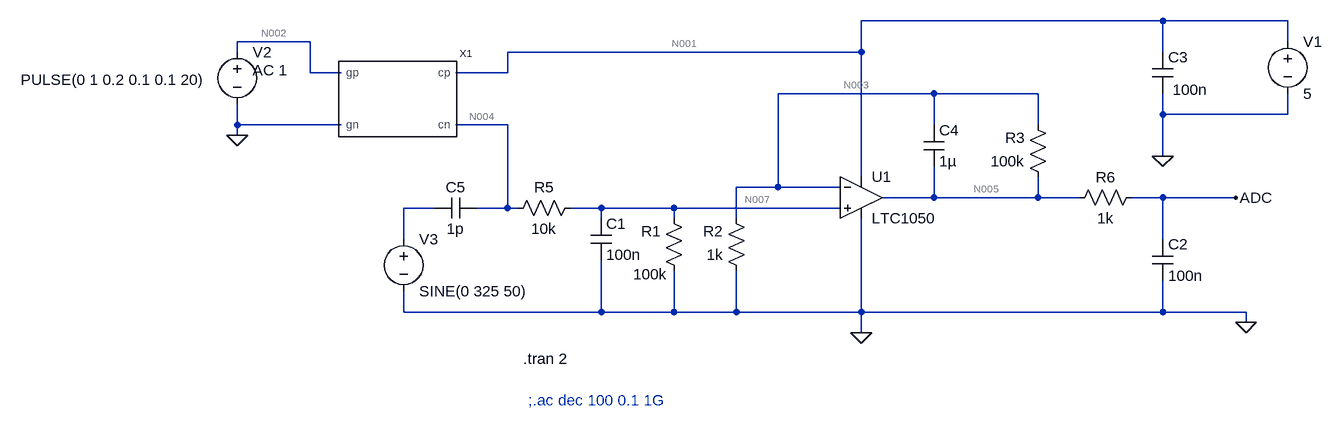
[diagram p0: schematic AmpliCapteur.asc]
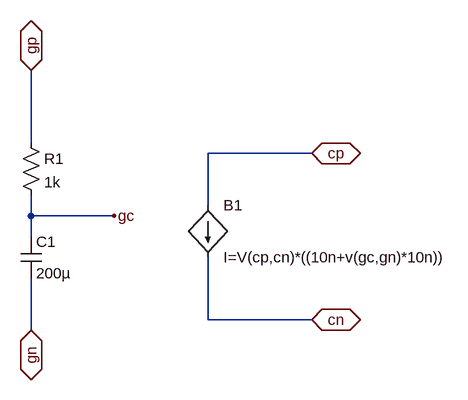
[diagram p1: sub-circuit capteur_gaz.asc]
AmpliCapteur.asc, the LTspice schematic file:
Version 4
SHEET 1 1176 680
WIRE 928 -144 464 -144
WIRE 1120 -144 928 -144
WIRE -384 -112 -496 -112
WIRE 1120 -112 1120 -144
WIRE -496 -96 -496 -112
WIRE 464 -96 464 -144
WIRE 464 -96 -80 -96
WIRE 928 -96 928 -144
WIRE -384 -64 -384 -112
WIRE -336 -64 -384 -64
WIRE -80 -64 -80 -96
WIRE -80 -64 -160 -64
WIRE 576 -32 336 -32
WIRE 736 -32 576 -32
WIRE 928 0 928 -32
WIRE 1120 0 1120 -32
WIRE 1120 0 928 0
WIRE -496 16 -496 -16
WIRE -336 16 -496 16
WIRE -80 16 -160 16
WIRE 576 16 576 -32
WIRE 736 16 736 -32
WIRE -496 32 -496 16
WIRE 928 64 928 0
WIRE 464 96 464 -96
WIRE 336 112 336 -32
WIRE 336 112 272 112
WIRE 432 112 336 112
WIRE 576 128 576 80
WIRE 576 128 496 128
WIRE 736 128 736 96
WIRE 736 128 576 128
WIRE 800 128 736 128
WIRE 928 128 880 128
WIRE 1040 128 928 128
WIRE -192 144 -240 144
WIRE -80 144 -80 16
WIRE -80 144 -128 144
WIRE -64 144 -80 144
WIRE 64 144 16 144
WIRE 176 144 64 144
WIRE 432 144 176 144
WIRE 64 160 64 144
WIRE 176 160 176 144
WIRE 272 160 272 112
WIRE -240 192 -240 144
WIRE 928 192 928 128
WIRE -240 304 -240 272
WIRE 64 304 64 224
WIRE 64 304 -240 304
WIRE 176 304 176 240
WIRE 176 304 64 304
WIRE 272 304 272 240
WIRE 272 304 176 304
WIRE 464 304 464 160
WIRE 464 304 272 304
WIRE 928 304 928 256
WIRE 928 304 464 304
WIRE 1056 304 928 304
WIRE 1056 320 1056 304
WIRE 464 336 464 304
FLAG 1056 320 0
FLAG 928 64 0
FLAG 464 336 0
FLAG 1040 128 ADC
FLAG -496 32 0
SYMBOL res 192 256 R180
WINDOW 0 36 76 Left 2
WINDOW 3 26 10 Left 2
SYMATTR InstName R1
SYMATTR Value 100k
SYMBOL res 288 256 R180
WINDOW 0 36 76 Left 2
WINDOW 3 36 40 Left 2
SYMATTR InstName R2
SYMATTR Value 1k
SYMBOL res 752 112 R180
WINDOW 0 36 76 Left 2
WINDOW 3 36 40 Left 2
SYMATTR InstName R3
SYMATTR Value 100k
SYMBOL res -80 160 R270
WINDOW 0 32 56 VTop 2
WINDOW 3 0 56 VBottom 2
SYMATTR InstName R5
SYMATTR Value 10k
SYMBOL cap 48 160 R0
SYMATTR InstName C1
SYMATTR Value 100n
SYMBOL cap 912 192 R0
SYMATTR InstName C2
SYMATTR Value 100n
SYMBOL cap 912 -96 R0
WINDOW 3 31 58 Left 2
SYMATTR Value 100n
SYMATTR InstName C3
SYMBOL cap 560 16 R0
SYMATTR InstName C4
SYMATTR Value 1µ
SYMATTR SpiceLine V=16 Irms=0 Rser=0 Lser=0 mfg="Murata" pn="GRM155R61C105KA12" type="X5R"
SYMBOL res 896 112 R90
WINDOW 0 0 56 VBottom 2
WINDOW 3 32 56 VTop 2
SYMATTR InstName R6
SYMATTR Value 1k
SYMBOL OpAmps\\LTC1050 464 64 R0
SYMATTR InstName U1
SYMBOL voltage 1120 -128 R0
WINDOW 123 0 0 Left 0
WINDOW 39 0 0 Left 0
SYMATTR InstName V1
SYMATTR Value 5
SYMBOL voltage -496 -112 R0
WINDOW 3 -333 59 Left 2
WINDOW 123 24 44 Left 2
WINDOW 39 0 0 Left 0
SYMATTR Value PULSE(0 1 0.2 0.1 0.1 20)
SYMATTR Value2 AC 1
SYMATTR InstName V2
SYMBOL Capteur_gaz -256 -32 R0
SYMATTR InstName X1
SYMBOL cap -128 128 R90
WINDOW 0 0 32 VBottom 2
WINDOW 3 32 32 VTop 2
SYMATTR InstName C5
SYMATTR Value 1p
SYMBOL voltage -240 176 R0
WINDOW 123 0 0 Left 0
WINDOW 39 0 0 Left 0
SYMATTR InstName V3
SYMATTR Value SINE(0 325 50)
TEXT -56 376 Left 2 !.tran 2
TEXT -48 440 Left 2 ;;.ac dec 100 0.1 1G

capteur_gaz.asc, the sub-circuit schematic file:
Version 4
SHEET 1 880 680
WIRE -80 32 -80 -80
WIRE 352 48 192 48
WIRE 192 128 192 48
WIRE -80 144 -80 112
WIRE 48 144 -80 144
WIRE -80 176 -80 144
WIRE 192 304 192 208
WIRE 352 304 192 304
WIRE -80 320 -80 240
FLAG 352 48 cp
IOPIN 352 48 BiDir
FLAG 352 304 cn
IOPIN 352 304 BiDir
FLAG -80 -80 gp
IOPIN -80 -80 BiDir
FLAG -80 320 gn
IOPIN -80 320 BiDir
FLAG 48 144 gc
SYMBOL bi 192 128 R0
SYMATTR InstName B1
SYMATTR Value I=V(cp,cn)*((10n+v(gc,gn)*10n))
SYMBOL res -96 16 R0
SYMATTR InstName R1
SYMATTR Value 1k
SYMBOL cap -96 176 R0
SYMATTR InstName C1
SYMATTR Value 200µ

The netlist it stands for:
* AmpliCapteur.asc
R1 0 N007 100k
R2 0 N003 1k
R3 N005 N003 100k
R5 N004 N007 10k
C1 N007 0 100n
C2 ADC 0 100n
C3 N001 0 100n
C4 N003 N005 1µ V=16 Irms=0 Rser=0 Lser=0 mfg="Murata" pn="GRM155R61C105KA12" type="X5R"
R6 ADC N005 1k
XU1 N007 N003 N001 0 N005 LTC1050  ; pins In+ In- V+ V- OUT
V1 N001 0 5
V2 N002 0 PULSE(0 1 0.2 0.1 0.1 20) AC 1
XX1 N001 N004 N002 0 capteur_gaz
C5 N004 N006 1p
V3 N006 0 SINE(0 325 50)

* block symbol definitions
.subckt capteur_gaz cp cn gp gn
B1 cp cn I=V(cp,cn)*((10n+v(gc,gn)*10n))
R1 gp gc 1k
C1 gc gn 200µ
.ends capteur_gaz

.tran 2
* ;.ac dec 100 0.1 1G
.lib LTC.lib
.backanno
.end

* Results of the author's LTspice run, read from the files saved beside the schematic
* Operating Point, zero values left out:
*   V(n007) = 4.995 mV
*   V(n003) = 4.995 mV
*   V(n005) = 504.4 mV
*   V(n004) = 5.494 mV
*   V(adc) = 504.4 mV
*   V(n001) = 5 V
*   I(R1) = -49.95 nA
*   I(R2) = -4.995 µA
*   I(R3) = 4.995 µA
*   I(R5) = 49.95 nA
*   I(V1) = -754.2 µA
*   Ix(u1:3) = 754.1 µA
*   Ix(u1:4) = -749.1 µA
*   Ix(u1:5) = -4.995 µA
*   Ix(x1:CP) = 49.95 nA
*   Ix(x1:CN) = -49.95 nA
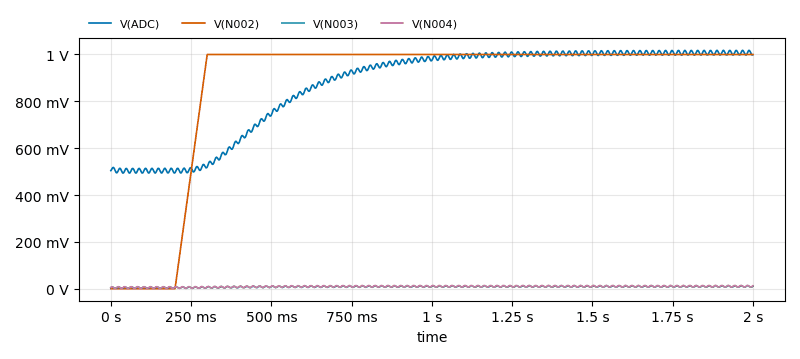
[diagram p2: Transient Analysis of AmpliCapteur.asc, plotted from the saved traces]
* Transient Analysis, 1 run:
*   V(ADC): min 493.8 mV, max 1.018 V, average 867.1 mV, rms 887.7 mV, last 999.1 mV
*   V(N002): min 0 V, max 1 V, average 875 mV, rms 930.9 mV, last 1 V
*   V(N003): min 1.679 mV, max 13.06 mV, average 8.828 mV, rms 9.259 mV, last 10.91 mV
*   V(N004): min 1.783 mV, max 14.45 mV, average 9.713 mV, rms 10.21 mV, last 12.91 mV